# Altium schematic sheet UG-003 Rev 3.SchDoc
size OrCAD A
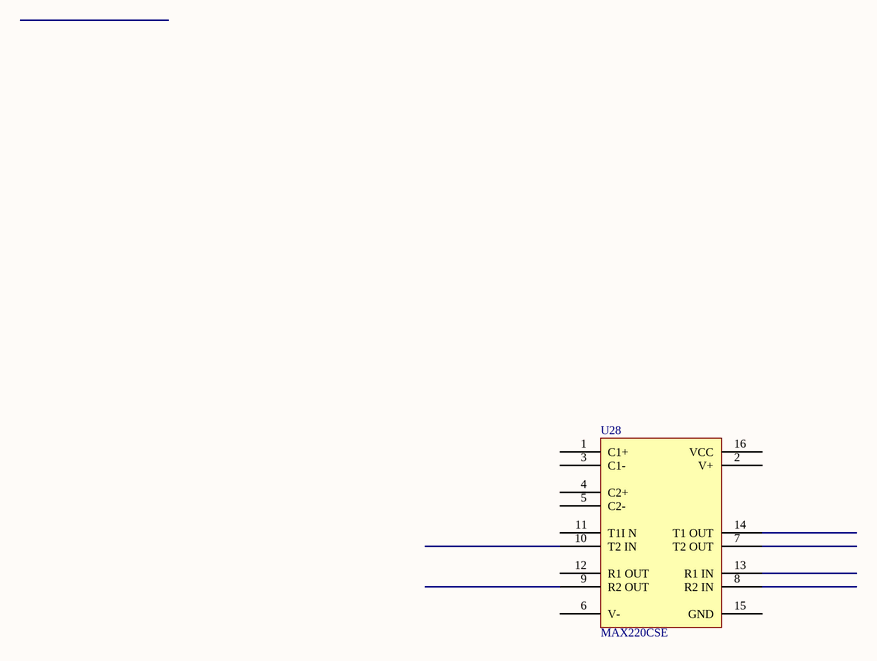
[diagram p0: UG-003 Rev 3.SchDoc]

## Parts
U28  MAX220CSE

## Nets

Not connected (* = marked no-connect by the designer): U28 1(C1+) 2(V+) 3(C1-) 4(C2+) 5(C2-) 6(V-) 7(T2_OUT) 8(R2_IN) 9(R2_OUT) 10(T2_IN) 11(T1I_N) 12(R1_OUT) 13(R1_IN) 14(T1_OUT) 15(GND) 16(VCC)

## Notes on the sheet
- Title
- Size:
- Date:
- Orcad A
- Number:
- Time:
- Revision:
- Sheet
- of
- ZLS Corporation
- 7801 North Lamar Blvd
- Suite E-184
- Austin, TX  78752
- Phone: (512) 453-0288
- File: